# EAGLE design untitled (EAGLE 9.5.0)
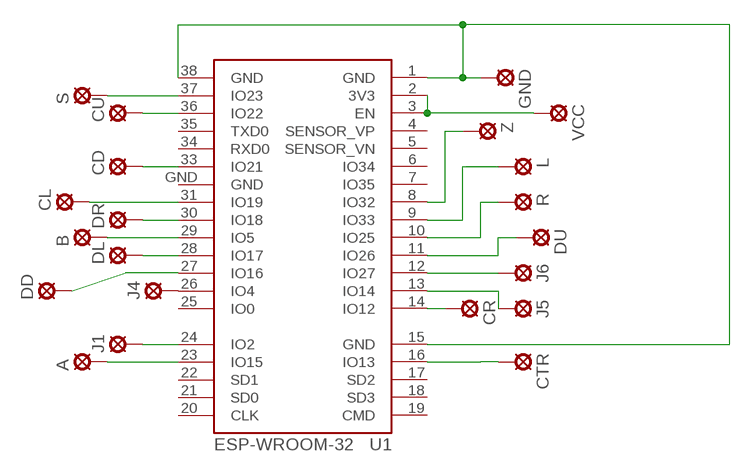
[diagram p0: schematic, sheet 1]

## Parts
A  LSP13  [LSP13]
B  LSP13  [LSP13]
CD  LSP13  [LSP13]
CL  LSP13  [LSP13]
CR  LSP13  [LSP13]
CTR  LSP13  [LSP13]
CU  LSP13  [LSP13]
DD  LSP13  [LSP13]
DL  LSP13  [LSP13]
DR  LSP13  [LSP13]
DU  LSP13  [LSP13]
GND  LSP13  [LSP13]
J1  LSP13  [LSP13]
J4  LSP13  [LSP13]
J5  LSP13  [LSP13]
J6  LSP13  [LSP13]
L  LSP13  [LSP13]
R  LSP13  [LSP13]
S  LSP13  [LSP13]
U1  ESP-WROOM-32  [ESP-WROOM-32]
VCC  LSP13  [LSP13]
Z  LSP13  [LSP13]

## Nets
GND: GND.MP U1.1(GND) U1.15(GND) U1.38(GND)
N$1: U1.8(IO32) Z.MP
N$2: U1.2(3V3) U1.3(EN) VCC.MP
N$3: CTR.MP U1.16(IO13)
N$4: A.MP U1.23(IO15)
N$5: B.MP U1.29(IO5)
N$6: S.MP U1.37(IO23)
N$7: J4.MP U1.26(IO4)
N$8: J1.MP U1.24(IO2)
N$9: J6.MP U1.12(IO27)
N$10: J5.MP U1.13(IO14)
N$11: L.MP U1.9(IO33)
N$12: R.MP U1.10(IO25)
N$13: DU.MP U1.11(IO26)
N$14: DD.MP U1.27(IO16)
N$15: DL.MP U1.28(IO17)
N$16: DR.MP U1.30(IO18)
N$17: CU.MP U1.36(IO22)
N$18: CD.MP U1.33(IO21)
N$19: CL.MP U1.31(IO19)
N$20: CR.MP U1.14(IO12)
Unconnected: U1.4(SENSOR_VP) U1.5(SENSOR_VN) U1.6(IO34) U1.7(IO35) U1.17(SD2) U1.18(SD3) U1.19(CMD) U1.20(CLK) U1.21(SD0) U1.22(SD1) U1.25(IO0) U1.34(RXD0) U1.35(TXD0)

## Power pins joined to a net without a drawn wire
GND: U1.GND

## Library data of the parts
A B CD CL CR CTR CU DD DL DR DU GND J1 J4-J6 L R S VCC Z = solpad:LSP13: SOLDER PAD drill 1.3 mm, distributor Buerklin, 12H562
U1 = esp32:ESP-WROOM-32: Espressif Systems ESP-WROOM-32

## Board
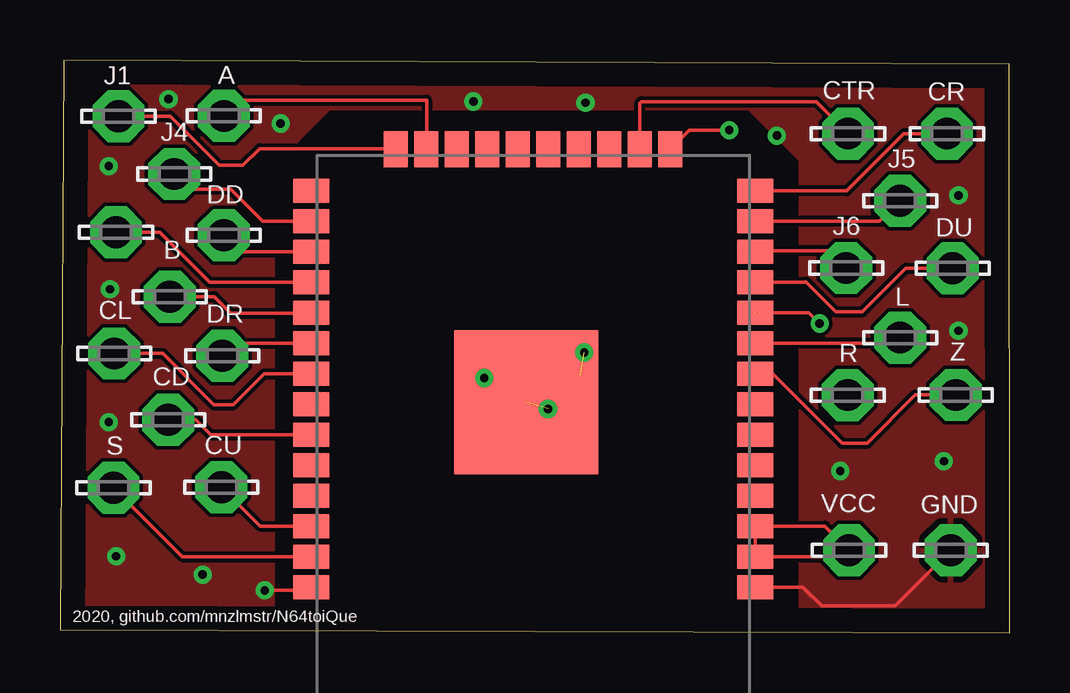
[diagram p1: board, top side]
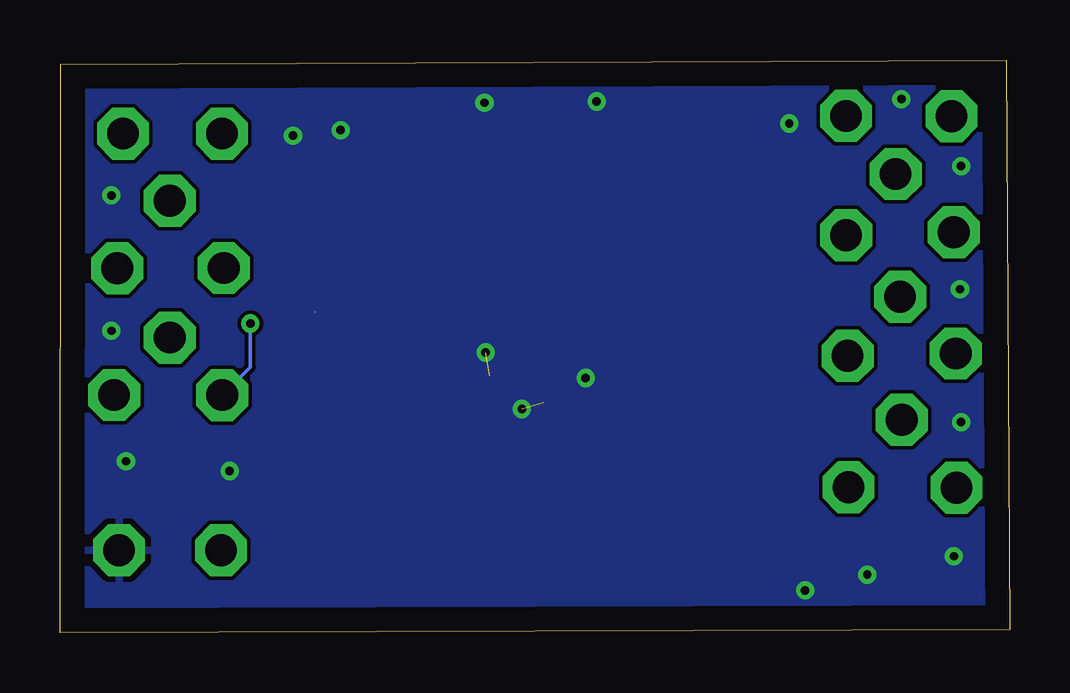
[diagram p2: board, bottom side, seen from below]

Size 39.58 x 23.85 mm. Coordinates in mm from the lower left corner, seen from the top.
Outline: 0,0.11 39.58,0 39.56,23.68 0.15,23.85 0,0.11
Copper layers (1*16): Top 0.035mm / dielectric 1.5mm / Bottom 0.035mm
Design rules "default": minimum track width 6mil, minimum drill 0.35mm, track to track 6mil, track to pad 6mil, pad to pad 6mil, via to via 6mil, smd to smd 6mil, copper to edge 40mil, drill to drill 6mil, minimum pad ring 10mil, minimum via ring 8mil, stop-mask expansion 4mil, vias tented up to drill 0mil, thermal gap 10mil

### Footprints (pad centres in the part's own frame; a part is rotated, then mirrored left to right if it is on the bottom)
LSP13 = drill 1.321 pad 2.159 octagon: MP 0,0
ESP-WROOM-32 = smd 1.5 x 1: 1 -9.25,7; 2 -9.25,5.73; 3 -9.25,4.46; 4 -9.25,3.19; 5 -9.25,1.92; 6 -9.25,0.65; 7 -9.25,-0.62; 8 -9.25,-1.89; 9 -9.25,-3.16; 10 -9.25,-4.43; 11 -9.25,-5.7; 12 -9.25,-6.97; 13 -9.25,-8.24; 14 -9.25,-9.51; 25 9.25,-9.51; 26 9.25,-8.24; 27 9.25,-6.97; 28 9.25,-5.7; 29 9.25,-4.43; 30 9.25,-3.16; 31 9.25,-1.89; 32 9.25,-0.62; 33 9.25,0.65; 34 9.25,1.92; 35 9.25,3.19; 36 9.25,4.46; 37 9.25,5.73; 38 9.25,7 | smd 1 x 1.5: 15 -5.7,-11.25; 16 -4.43,-11.25; 17 -3.16,-11.25; 18 -1.89,-11.25; 19 -0.62,-11.25; 20 0.65,-11.25; 21 1.92,-11.25; 22 3.19,-11.25; 23 4.46,-11.25; 24 5.73,-11.25 | smd 6 x 6: GND 0.3,-0.7

### Placement (x,y rotation side)
A  6.83,21.53 0 top
B  4.58,13.99 0 top
CD  4.51,8.86 0 top
CL  2.26,11.63 0 top
CR  36.96,20.79 0 top
CTR  32.83,20.79 0 top
CU  6.72,6.05 0 top
DD  6.82,16.55 0 top
DL  2.34,16.68 0 top
DR  6.76,11.53 0 top
DU  37.19,15.18 0 top
GND  37.12,3.43 0 top
J1  2.44,21.51 0 top
J4  4.76,19.11 0 top
J5  35,17.99 0 top
J6  32.76,15.19 0 top
L  35,12.29 0 top
R  32.82,9.89 0 top
S  2.23,6.03 0 top
U1  19.72,8.89 180 top
VCC  32.87,3.43 0 top
Z  37.32,9.9 0 top

### Tracks (layer width: path | path; a pad name or v marks a point on that pad's centre or on a via)
GND  (via drill 0.35)  (2 unrouted)
  Top 0.152: U1.1 30.96,1.89 31.73,1.11 31.76,1.11 34.8,1.11 GND.MP | 21.68,7.37 21.68,10.69 | U1.38 10.34,1.76 v8.53,1.76 | v17.68,10.6 20.78,10.6 v21.84,11.67 | v27.89,20.93 26.21,20.93 U1.15
  Bottom 0.152: 17.38,10.6 v17.68,10.6
  other vias: 20.33,9.31 9.19,21.21 2.03,19.43 2.08,14.3 2.03,8.76 2.34,3.18 5.94,2.41 17.22,22.12 21.89,22.07 29.87,20.7 37.44,18.21 37.44,12.57 36.83,7.14 32.51,6.73 4.52,22.23
  pour Bottom (rank 6): -3.2,-7.8 -3.2,25.63 -1.52,27.31 44.25,27.31 44.96,26.59 44.96,-6.88 42.37,-9.47 -1.52,-9.47
  pour Top (rank 6): 8.74,0.69 8.74,19.33 11.23,21.82 28.7,21.82 30.84,19.69 30.84,0.18 32.05,-1.04 39.88,-1.04 40.54,-0.38 40.54,24.61 39.67,25.48 -1.32,25.48 -1.32,0.69 -0.46,-0.18 7.77,-0.18 8.69,0.74
  pour Top (rank 6): -1.07,-0.84 8.84,-0.84 8.89,-0.79 8.89,20.14 10.62,21.87 28.7,21.87 31.55,19.02 31.55,-1.24 32,-1.7 40.69,-1.7 41.5,-0.89 41.5,23.09 39.01,25.58 -0.46,25.58 -1.88,24.16 -1.88,0.03 -1.07,-0.79
N$1
  Top 0.152: U1.8 29.7,10.78 32.59,7.88 33.63,7.88 35.65,9.9 Z.MP
N$2
  Top 0.152: U1.3 U1.2 32.6,3.16 VCC.MP 31.87,4.43 U1.3
N$3
  Top 0.152: 24.13,20.12 U1.16 24.15,22.04 24.22,22.12 31.5,22.12 CTR.MP
N$4
  Top 0.152: A.MP 7.48,22.18 15.27,22.18 15.27,20.15 U1.23
N$5
  Top 0.152: B.MP 6.44,13.99 7.12,13.31 U1.29
N$6
  Top 0.152: S.MP 5.1,3.16 U1.37
N$7
  Top 0.152: U1.26 8.45,17.13 7.11,18.46 5.4,18.46 J4.MP
N$8
  Top 0.152: J1.MP 4.59,21.51 6.64,19.46 7.62,19.46 8.32,20.16 13.97,20.16 U1.24
N$9
  Top 0.152: J6.MP 32.25,15.69 32.25,15.9 29.01,15.9 U1.12
N$10
  Top 0.152: J5.MP 34.14,17.13 U1.13
N$11
  Top 0.152: L.MP 34.77,12.05 U1.9
N$12  (via drill 0.35)  (1 unrouted)
  Top 0.152: 28.95,13.35 U1.10 31.2,13.32 v31.65,12.87 | 28.97,13.35
  Bottom 0.152: R.MP 31.65,11.06 v31.65,12.87
N$13
  Top 0.152: U1.11 31.06,14.59 31.08,14.61 | 31.08,14.61 | 31.08,14.61 32.33,13.36 33.43,13.36 35.25,15.18 DU.MP
  Bottom 0.152: DU.MP
N$14
  Top 0.152: DD.MP 7.52,15.86 U1.27
N$15
  Top 0.152: DL.MP 4.16,16.68 6.24,14.59 U1.28
N$16
  Top 0.152: DR.MP 7.25,12.02 7.25,12.04 7.26,12.05 U1.30
N$17
  Top 0.152: 10.57,4.43 U1.36 8.35,4.43 CU.MP
N$18
  Top 0.152: CD.MP 5.65,8.86 6.28,8.24 U1.33
N$19
  Top 0.152: CL.MP 4.27,11.63 6.41,9.49 7.21,9.49 8.51,10.78 U1.31
N$20
  Top 0.152: CR.MP 35.16,20.79 32.77,18.4 U1.14

### Text on the board
tPlace: 2020, github.com/mnzlmstr/N64toiQue